# Altium schematic sheet Kicker.SchDoc
size A3
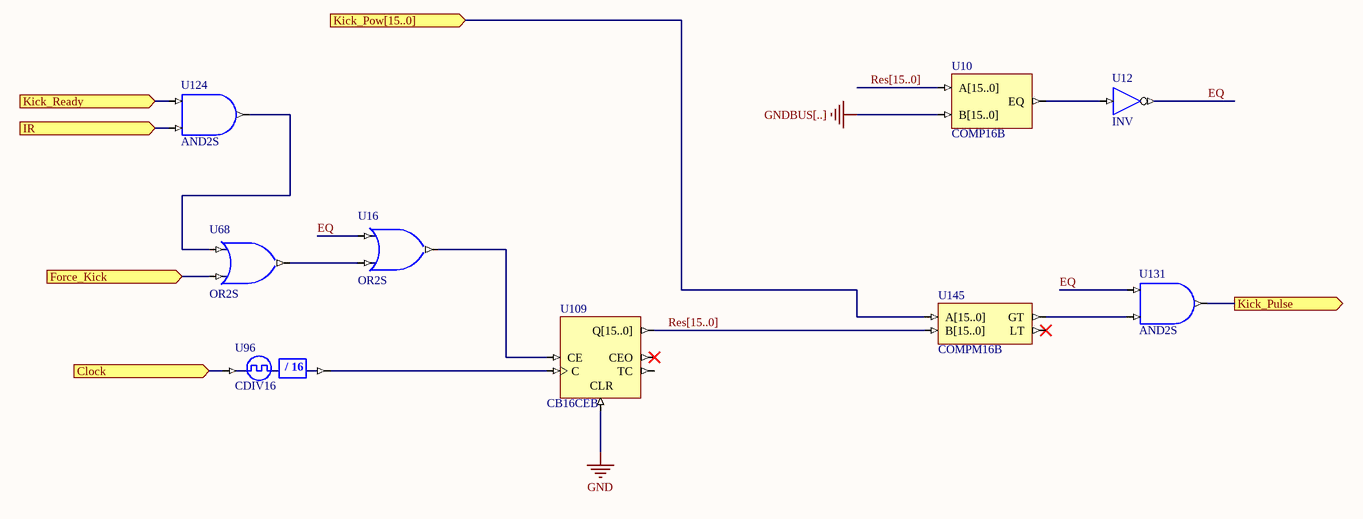
[diagram p0: Kicker.SchDoc]

## Parts
U10  COMP16B
U12  INV
U16  OR2S
U68  OR2S
U96  CDIV16
U109  CB16CEB
U124  AND2S
U131  AND2S
U145  COMPM16B

## Ports
Clock (in), Force_Kick (in), IR (in), Kick_Pow[15..0] (in), Kick_Pulse (out), Kick_Ready (in)

## Nets
GND: U109.CLR
GNDBUS[..]: U10.B[15..0]
Clock: U96.CLKIN ; port Clock
EQ: U12.O U16.I0 U131.I0
Force_Kick: U68.I1 ; port Force_Kick
IR: U124.I1 ; port IR
Kick_Pow[15..0]: U145.A[15..0] ; port Kick_Pow[15..0]
Kick_Pulse: U131.O ; port Kick_Pulse
Kick_Ready: U124.I0 ; port Kick_Ready
Res[15..0]: U10.A[15..0] U109.Q[15..0] U145.B[15..0]
NetU10_EQ: U10.EQ U12.I
NetU16_I1: U16.I1 U68.O
NetU16_O: U16.O U109.CE
NetU68_I0: U68.I0 U124.O
NetU96_CLKDV: U96.CLKDV U109.C
NetU131_I1: U131.I1 U145.GT

Not connected (* = marked no-connect by the designer): U109 CEO* TC; U145 LT*

## Buses and harness runs
bus Res[15..0]

## Notes on the sheet
- (in symbol CDIV16) / 16

## Library data of the parts
U10 = COMP16B: 16-Bit Identity Comparator, Bus Version; XilinxEquivalent: COMP16; SubClass: COMP; PortSize: 16; ArchiveName: GENERIC; VHDLIB_SIM: GENERIC_LIB; Published: 29-Jan-2004; Publisher: Altium Limited; LastRevisionNo: 1.00.00; HelpURL: CR0118 FPGA Generic Library Guide.pdf#page=151; ComponentLink1URL: CR0129 FPGA Comparator Resource Usage.pdf#page=22; ComponentLink1Description: Core &Resource Usage; FunctionalClass: Comparator; PortStyle: Bus Version
U12 = INV: Inverter; FunctionalClass: Logic Primitive; ArchiveName: GENERIC; VHDLIB_SIM: GENERIC_LIB; Published: 29-Jan-2004; Publisher: Altium Limited; XilinxEquivalent: INV; LastRevisionNo: 1.00.00; HelpURL: CR0118 FPGA Generic Library Guide.pdf#page=291; ComponentLink1URL: CR0136 FPGA Logic Primitive Resource Usage.pdf#page=61; ComponentLink1Description: Core &Resource Usage; SubClass: INV
U16 U68 = OR2: 2-Input OR Gate, Single Pin Version; XilinxEquivalent: OR2; FunctionalClass: Logic Primitive; PortSize: 2; ArchiveName: GENERIC; VHDLIB_SIM: GENERIC_LIB; Published: 29-Jan-2004; Publisher: Altium Limited; LastRevisionNo: 1.00.00; HelpURL: CR0118 FPGA Generic Library Guide.pdf#page=410; ComponentLink1URL: CR0136 FPGA Logic Primitive Resource Usage.pdf#page=190; ComponentLink1Description: Core &Resource Usage; SubClass: OR; PortStyle: Single Pin Version
U96 = CDIV16: Clock Divider by 16; DivisorRate: 16; ArchiveName: GENERIC; VHDLIB_SIM: GENERIC_LIB; Published: 29-Jan-2004; Publisher: Altium Limited; LastRevisionNo: 1.00.00; HelpURL: CR0118 FPGA Generic Library Guide.pdf#page=142; ComponentLink1URL: CR0127 FPGA Clock Divider Resource Usage.pdf#page=18; ComponentLink1Description: Core &Resource Usage; FunctionalClass: Clock Divider
U109 = CB16CEB: 16-Bit Cascadable Binary Counters with Clock Enable and Asynchronous Clear, Bus Version; XilinxEquivalent: CB16CE; ClockTrigger: Rising; Enable: High; PortSize: 16; ArchiveName: GENERIC; VHDLIB_SIM: GENERIC_LIB; Published: 29-Jan-2004; Publisher: Altium Limited; LastRevisionNo: 1.00.00; HelpURL: CR0118 FPGA Generic Library Guide.pdf#page=128; ComponentLink1URL: CR0130 FPGA Counter Resource Usage.pdf#page=33; ComponentLink1Description: Core &Resource Usage; FunctionalClass: Counter; SubClass: Binary; Reset: Asynchronous; PortType: Bus Version
U124 U131 = AND2: 2-Input AND Gate, Single Pin Version; XilinxEquivalent: AND2; FunctionalClass: Logic Primitive; PortSize: 2; ArchiveName: GENERIC; VHDLIB_SIM: GENERIC_LIB; Published: 29-Jan-2004; Publisher: Altium Limited; LastRevisionNo: 1.00.00; HelpURL: CR0118 FPGA Generic Library Guide.pdf#page=114; ComponentLink1URL: CR0136 FPGA Logic Primitive Resource Usage.pdf#page=13; ComponentLink1Description: Core &Resource Usage; SubClass: AND; PortStyle: Single Pin Version
U145 = COMPM16B: 16-Bit Magnitude Comparator, Bus Version; SubClass: COMPM; PortSize: 16; ArchiveName: GENERIC; VHDLIB_SIM: GENERIC_LIB; Published: 29-Jan-2004; Publisher: Altium Limited; XilinxEquivalent: COMPM16; LastRevisionNo: 1.00.00; HelpURL: CR0118 FPGA Generic Library Guide.pdf#page=153; ComponentLink1URL: CR0129 FPGA Comparator Resource Usage.pdf#page=45; ComponentLink1Description: Core &Resource Usage; FunctionalClass: Comparator; PortStyle: Bus Version